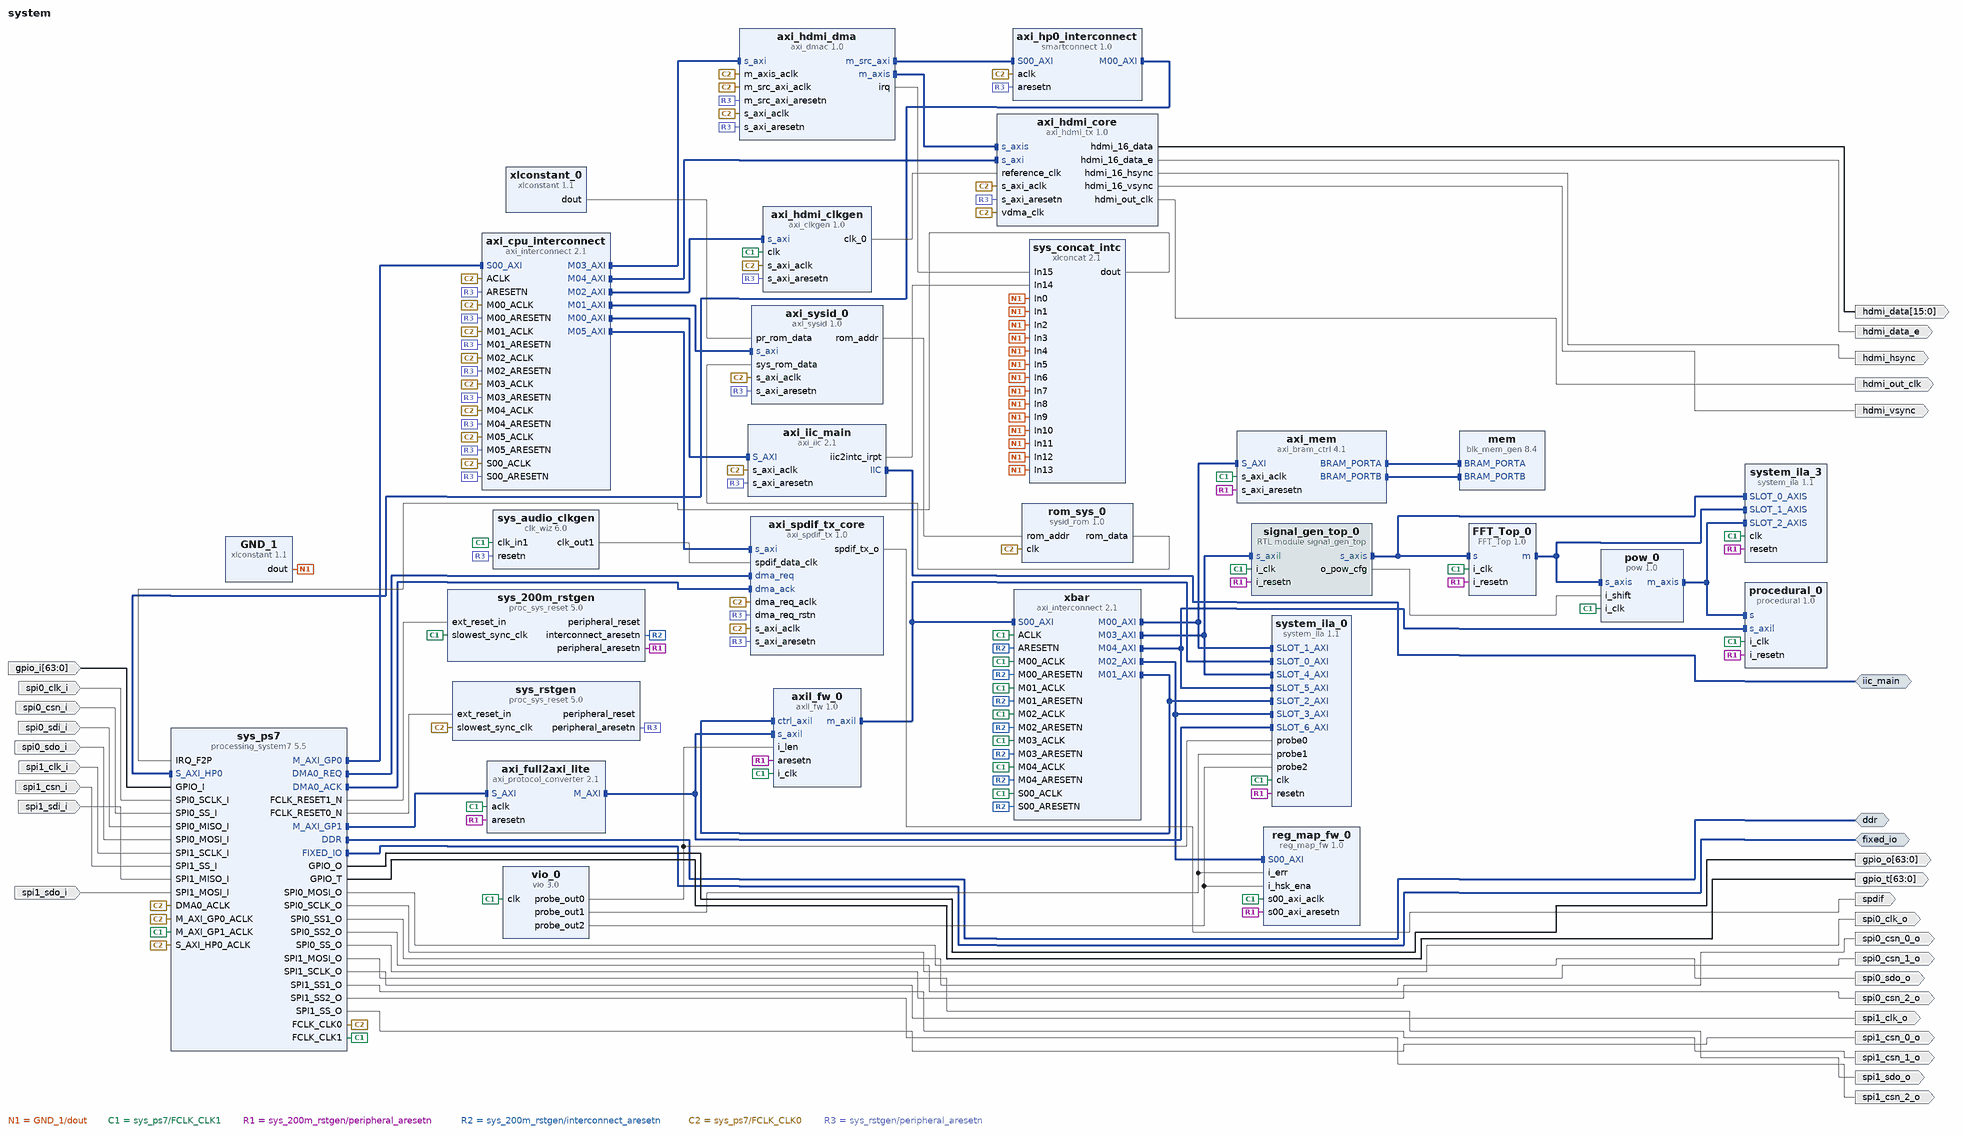
[diagram p0: block diagram of the top level]
# Vivado block design system, xc7z020clg484-1, Vivado 2021.1
create_bd_design system

create_bd_intf_port -mode Master -vlnv xilinx.com:interface:ddrx_rtl:1.0 ddr
create_bd_intf_port -mode Master -vlnv xilinx.com:display_processing_system7:fixedio_rtl:1.0 fixed_io
create_bd_intf_port -mode Master -vlnv xilinx.com:interface:iic_rtl:1.0 iic_main
create_bd_port -dir O spi0_csn_2_o
create_bd_port -dir O spi0_csn_1_o
create_bd_port -dir O spi0_csn_0_o
create_bd_port -dir I spi0_csn_i
create_bd_port -dir I spi0_clk_i
create_bd_port -dir O spi0_clk_o
create_bd_port -dir I spi0_sdo_i
create_bd_port -dir O spi0_sdo_o
create_bd_port -dir I spi0_sdi_i
create_bd_port -dir O spi1_csn_2_o
create_bd_port -dir O spi1_csn_1_o
create_bd_port -dir O spi1_csn_0_o
create_bd_port -dir I spi1_csn_i
create_bd_port -dir I spi1_clk_i
create_bd_port -dir O spi1_clk_o
create_bd_port -dir I spi1_sdo_i
create_bd_port -dir O spi1_sdo_o
create_bd_port -dir I spi1_sdi_i
create_bd_port -dir I -from 63 -to 0 gpio_i
create_bd_port -dir O -from 63 -to 0 gpio_o
create_bd_port -dir O -from 63 -to 0 gpio_t
create_bd_port -dir O hdmi_out_clk
create_bd_port -dir O hdmi_hsync
create_bd_port -dir O hdmi_vsync
create_bd_port -dir O hdmi_data_e
create_bd_port -dir O -from 15 -to 0 hdmi_data
create_bd_port -dir O spdif

create_bd_cell -type ip -vlnv xilinx.com:ip:processing_system7:5.5 sys_ps7
set_property -dict [list \
  CONFIG.PCW_APU_PERIPHERAL_FREQMHZ 666.666666 \
  CONFIG.PCW_CAN0_CAN0_IO {MIO 46 .. 47} \
  CONFIG.PCW_CAN0_PERIPHERAL_ENABLE 1 \
  CONFIG.PCW_CAN_PERIPHERAL_FREQMHZ 23.8095 \
  CONFIG.PCW_ENET0_ENET0_IO {MIO 16 .. 27} \
  CONFIG.PCW_ENET0_GRP_MDIO_ENABLE 1 \
  CONFIG.PCW_ENET0_GRP_MDIO_IO {MIO 52 .. 53} \
  CONFIG.PCW_ENET0_PERIPHERAL_ENABLE 1 \
  CONFIG.PCW_ENET0_PERIPHERAL_FREQMHZ {100 Mbps} \
  CONFIG.PCW_ENET0_RESET_ENABLE 1 \
  CONFIG.PCW_ENET0_RESET_IO {MIO 11} \
  CONFIG.PCW_ENET_RESET_ENABLE 1 \
  CONFIG.PCW_ENET_RESET_SELECT {Share reset pin} \
  CONFIG.PCW_EN_CLK1_PORT 1 \
  CONFIG.PCW_EN_RST1_PORT 1 \
  CONFIG.PCW_FCLK_CLK1_BUF TRUE \
  CONFIG.PCW_FPGA0_PERIPHERAL_FREQMHZ 100.0 \
  CONFIG.PCW_FPGA1_PERIPHERAL_FREQMHZ 200.0 \
  CONFIG.PCW_FPGA_FCLK1_ENABLE 1 \
  CONFIG.PCW_GPIO_EMIO_GPIO_ENABLE 1 \
  CONFIG.PCW_GPIO_EMIO_GPIO_IO 64 \
  CONFIG.PCW_GPIO_MIO_GPIO_ENABLE 1 \
  CONFIG.PCW_GPIO_MIO_GPIO_IO MIO \
  CONFIG.PCW_I2C0_GRP_INT_ENABLE 0 \
  CONFIG.PCW_I2C0_I2C0_IO {MIO 50 .. 51} \
  CONFIG.PCW_I2C0_PERIPHERAL_ENABLE 1 \
  CONFIG.PCW_I2C0_RESET_ENABLE 1 \
  CONFIG.PCW_I2C0_RESET_IO {MIO 13} \
  CONFIG.PCW_I2C_PERIPHERAL_FREQMHZ 111.111115 \
  CONFIG.PCW_I2C_RESET_ENABLE 1 \
  CONFIG.PCW_I2C_RESET_SELECT {Share reset pin} \
  CONFIG.PCW_IMPORT_BOARD_PRESET ZC702 \
  CONFIG.PCW_IRQ_F2P_INTR 1 \
  CONFIG.PCW_PRESET_BANK0_VOLTAGE {LVCMOS 1.8V} \
  CONFIG.PCW_PRESET_BANK1_VOLTAGE {LVCMOS 1.8V} \
  CONFIG.PCW_QSPI_GRP_FBCLK_ENABLE 1 \
  CONFIG.PCW_QSPI_GRP_FBCLK_IO {MIO 8} \
  CONFIG.PCW_QSPI_GRP_SINGLE_SS_ENABLE 1 \
  CONFIG.PCW_QSPI_GRP_SINGLE_SS_IO {MIO 1 .. 6} \
  CONFIG.PCW_QSPI_PERIPHERAL_ENABLE 1 \
  CONFIG.PCW_QSPI_QSPI_IO {MIO 1 .. 6} \
  CONFIG.PCW_SD0_GRP_CD_ENABLE 1 \
  CONFIG.PCW_SD0_GRP_CD_IO {MIO 0} \
  CONFIG.PCW_SD0_GRP_WP_ENABLE 1 \
  CONFIG.PCW_SD0_GRP_WP_IO {MIO 15} \
  CONFIG.PCW_SD0_PERIPHERAL_ENABLE 1 \
  CONFIG.PCW_SD0_SD0_IO {MIO 40 .. 45} \
  CONFIG.PCW_SDIO_PERIPHERAL_FREQMHZ 50 \
  CONFIG.PCW_SINGLE_QSPI_DATA_MODE x4 \
  CONFIG.PCW_SPI0_PERIPHERAL_ENABLE 1 \
  CONFIG.PCW_SPI0_SPI0_IO EMIO \
  CONFIG.PCW_SPI1_PERIPHERAL_ENABLE 1 \
  CONFIG.PCW_SPI1_SPI1_IO EMIO \
  CONFIG.PCW_UART1_PERIPHERAL_ENABLE 1 \
  CONFIG.PCW_UART1_UART1_IO {MIO 48 .. 49} \
  CONFIG.PCW_UART_PERIPHERAL_FREQMHZ 50 \
  CONFIG.PCW_UIPARAM_DDR_FREQ_MHZ 533.333333 \
  CONFIG.PCW_UIPARAM_DDR_PARTNO {MT41J256M8 HX-15E} \
  CONFIG.PCW_USB0_PERIPHERAL_ENABLE 1 \
  CONFIG.PCW_USB0_RESET_ENABLE 1 \
  CONFIG.PCW_USB0_RESET_IO {MIO 7} \
  CONFIG.PCW_USB0_USB0_IO {MIO 28 .. 39} \
  CONFIG.PCW_USB_RESET_ENABLE 1 \
  CONFIG.PCW_USB_RESET_SELECT {Share reset pin} \
  CONFIG.PCW_USE_DMA0 1 \
  CONFIG.PCW_USE_FABRIC_INTERRUPT 1 \
  CONFIG.PCW_USE_M_AXI_GP1 1 \
  CONFIG.PCW_USE_S_AXI_HP0 1 \
] [get_bd_cells sys_ps7]
# 424 more settings of sys_ps7 are not shown: defaults, MIO pin electricals, DDR timing, and values the tool derives
create_bd_cell -type ip -vlnv xilinx.com:ip:axi_iic:2.1 axi_iic_main
set_property -dict {CONFIG.IIC_BOARD_INTERFACE iic_main CONFIG.USE_BOARD_FLOW true} [get_bd_cells axi_iic_main]
create_bd_cell -type ip -vlnv xilinx.com:ip:xlconcat:2.1 sys_concat_intc
set_property -dict {CONFIG.NUM_PORTS 16} [get_bd_cells sys_concat_intc]
create_bd_cell -type ip -vlnv xilinx.com:ip:proc_sys_reset:5.0 sys_rstgen
set_property -dict {CONFIG.C_EXT_RST_WIDTH 1} [get_bd_cells sys_rstgen]
create_bd_cell -type ip -vlnv xilinx.com:ip:proc_sys_reset:5.0 sys_200m_rstgen
set_property -dict {CONFIG.C_EXT_RST_WIDTH 1} [get_bd_cells sys_200m_rstgen]
create_bd_cell -type ip -vlnv analog.com:user:axi_clkgen:1.0 axi_hdmi_clkgen
create_bd_cell -type ip -vlnv analog.com:user:axi_hdmi_tx:1.0 axi_hdmi_core
set_property -dict {CONFIG.INTERFACE 16_BIT} [get_bd_cells axi_hdmi_core]
create_bd_cell -type ip -vlnv analog.com:user:axi_dmac:1.0 axi_hdmi_dma
set_property -dict [list \
  CONFIG.AXI_SLICE_DEST false \
  CONFIG.AXI_SLICE_SRC false \
  CONFIG.CYCLIC true \
  CONFIG.DMA_2D_TRANSFER true \
  CONFIG.DMA_DATA_WIDTH_SRC 64 \
  CONFIG.DMA_TYPE_DEST 1 \
  CONFIG.DMA_TYPE_SRC 0 \
] [get_bd_cells axi_hdmi_dma]
create_bd_cell -type ip -vlnv xilinx.com:ip:clk_wiz:6.0 sys_audio_clkgen
set_property -dict [list \
  CONFIG.CLKOUT1_REQUESTED_OUT_FREQ 12.288 \
  CONFIG.PRIM_SOURCE No_buffer \
  CONFIG.RESET_TYPE ACTIVE_LOW \
  CONFIG.USE_LOCKED false \
  CONFIG.USE_PHASE_ALIGNMENT false \
  CONFIG.USE_RESET true \
] [get_bd_cells sys_audio_clkgen]
create_bd_cell -type ip -vlnv analog.com:user:axi_spdif_tx:1.0 axi_spdif_tx_core
set_property -dict {CONFIG.DMA_TYPE 1 CONFIG.S_AXI_ADDRESS_WIDTH 16} [get_bd_cells axi_spdif_tx_core]
create_bd_cell -type ip -vlnv analog.com:user:axi_sysid:1.0 axi_sysid_0
set_property -dict {CONFIG.ROM_ADDR_BITS 9} [get_bd_cells axi_sysid_0]
create_bd_cell -type ip -vlnv analog.com:user:sysid_rom:1.0 rom_sys_0
set_property -dict [list \
  CONFIG.PATH_TO_FILE /home/grigory/teset/hdl/projects/adv7511/zc702/mem_init_sys.txt \
  CONFIG.ROM_ADDR_BITS 9 \
] [get_bd_cells rom_sys_0]
create_bd_cell -type ip -vlnv xilinx.com:ip:xlconstant:1.1 GND_1
set_property -dict {CONFIG.CONST_VAL 0 CONFIG.CONST_WIDTH 1} [get_bd_cells GND_1]
create_bd_cell -type ip -vlnv xilinx.com:ip:axi_interconnect:2.1 axi_cpu_interconnect
set_property -dict {CONFIG.NUM_MI 6} [get_bd_cells axi_cpu_interconnect]
create_bd_cell -type ip -vlnv xilinx.com:ip:smartconnect:1.0 axi_hp0_interconnect
set_property -dict {CONFIG.NUM_MI 1 CONFIG.NUM_SI 1} [get_bd_cells axi_hp0_interconnect]
create_bd_cell -type ip -vlnv xilinx.com:ip:axi_protocol_converter:2.1 axi_full2axi_lite
set_property -dict [list \
  CONFIG.MI_PROTOCOL AXI4LITE \
  CONFIG.SI_PROTOCOL AXI3 \
  CONFIG.TRANSLATION_MODE 2 \
] [get_bd_cells axi_full2axi_lite]
create_bd_cell -type ip -vlnv xilinx.com:ip:axi_interconnect:2.1 xbar
set_property -dict [list \
  CONFIG.M00_HAS_DATA_FIFO 1 \
  CONFIG.M00_HAS_REGSLICE 3 \
  CONFIG.M01_HAS_DATA_FIFO 1 \
  CONFIG.M01_HAS_REGSLICE 3 \
  CONFIG.NUM_MI 5 \
  CONFIG.S00_HAS_DATA_FIFO 1 \
  CONFIG.S00_HAS_REGSLICE 4 \
] [get_bd_cells xbar]
create_bd_cell -type ip -vlnv xilinx.com:ip:blk_mem_gen:8.4 mem
set_property -dict [list \
  CONFIG.Assume_Synchronous_Clk true \
  CONFIG.Enable_B Use_ENB_Pin \
  CONFIG.Memory_Type True_Dual_Port_RAM \
  CONFIG.Port_B_Clock 100 \
  CONFIG.Port_B_Enable_Rate 100 \
  CONFIG.Port_B_Write_Rate 50 \
  CONFIG.Use_RSTB_Pin true \
] [get_bd_cells mem]
create_bd_cell -type ip -vlnv xilinx.com:ip:axi_bram_ctrl:4.1 axi_mem
set_property -dict {CONFIG.PROTOCOL AXI4LITE} [get_bd_cells axi_mem]
create_bd_cell -type ip -vlnv xilinx.com:ip:vio:3.0 vio_0
set_property -dict [list \
  CONFIG.C_NUM_PROBE_IN 0 \
  CONFIG.C_NUM_PROBE_OUT 3 \
  CONFIG.C_PROBE_OUT0_INIT_VAL 0x32 \
  CONFIG.C_PROBE_OUT0_WIDTH 10 \
  CONFIG.C_PROBE_OUT2_INIT_VAL 0x1F \
  CONFIG.C_PROBE_OUT2_WIDTH 5 \
] [get_bd_cells vio_0]
create_bd_cell -type ip -vlnv xilinx.com:ip:xlconstant:1.1 xlconstant_0
set_property -dict {CONFIG.CONST_VAL 0 CONFIG.CONST_WIDTH 32} [get_bd_cells xlconstant_0]
create_bd_cell -type ip -vlnv xilinx.com:ip:system_ila:1.1 system_ila_0
set_property -dict [list \
  CONFIG.C_INPUT_PIPE_STAGES 6 \
  CONFIG.C_MON_TYPE MIX \
  CONFIG.C_NUM_MONITOR_SLOTS 7 \
  CONFIG.C_NUM_OF_PROBES 3 \
  CONFIG.C_PROBE0_TYPE 0 \
  CONFIG.C_PROBE1_TYPE 0 \
  CONFIG.C_PROBE2_TYPE 0 \
  CONFIG.C_SLOT_0_APC_EN 0 \
  CONFIG.C_SLOT_0_AXI_AR_SEL_DATA 1 \
  CONFIG.C_SLOT_0_AXI_AR_SEL_TRIG 1 \
  CONFIG.C_SLOT_0_AXI_AW_SEL_DATA 1 \
  CONFIG.C_SLOT_0_AXI_AW_SEL_TRIG 1 \
  CONFIG.C_SLOT_0_AXI_B_SEL_DATA 1 \
  CONFIG.C_SLOT_0_AXI_B_SEL_TRIG 1 \
  CONFIG.C_SLOT_0_AXI_R_SEL_DATA 1 \
  CONFIG.C_SLOT_0_AXI_R_SEL_TRIG 1 \
  CONFIG.C_SLOT_0_AXI_W_SEL_DATA 1 \
  CONFIG.C_SLOT_0_AXI_W_SEL_TRIG 1 \
  CONFIG.C_SLOT_0_INTF_TYPE xilinx.com:interface:aximm_rtl:1.0 \
  CONFIG.C_SLOT_1_APC_EN 0 \
  CONFIG.C_SLOT_1_AXI_AR_SEL_DATA 1 \
  CONFIG.C_SLOT_1_AXI_AR_SEL_TRIG 1 \
  CONFIG.C_SLOT_1_AXI_AW_SEL_DATA 1 \
  CONFIG.C_SLOT_1_AXI_AW_SEL_TRIG 1 \
  CONFIG.C_SLOT_1_AXI_B_SEL_DATA 1 \
  CONFIG.C_SLOT_1_AXI_B_SEL_TRIG 1 \
  CONFIG.C_SLOT_1_AXI_R_SEL_DATA 1 \
  CONFIG.C_SLOT_1_AXI_R_SEL_TRIG 1 \
  CONFIG.C_SLOT_1_AXI_W_SEL_DATA 1 \
  CONFIG.C_SLOT_1_AXI_W_SEL_TRIG 1 \
  CONFIG.C_SLOT_1_INTF_TYPE xilinx.com:interface:aximm_rtl:1.0 \
  CONFIG.C_SLOT_2_APC_EN 0 \
  CONFIG.C_SLOT_2_AXI_AR_SEL_DATA 1 \
  CONFIG.C_SLOT_2_AXI_AR_SEL_TRIG 1 \
  CONFIG.C_SLOT_2_AXI_AW_SEL_DATA 1 \
  CONFIG.C_SLOT_2_AXI_AW_SEL_TRIG 1 \
  CONFIG.C_SLOT_2_AXI_B_SEL_DATA 1 \
  CONFIG.C_SLOT_2_AXI_B_SEL_TRIG 1 \
  CONFIG.C_SLOT_2_AXI_R_SEL_DATA 1 \
  CONFIG.C_SLOT_2_AXI_R_SEL_TRIG 1 \
  CONFIG.C_SLOT_2_AXI_W_SEL_DATA 1 \
  CONFIG.C_SLOT_2_AXI_W_SEL_TRIG 1 \
  CONFIG.C_SLOT_2_INTF_TYPE xilinx.com:interface:aximm_rtl:1.0 \
  CONFIG.C_SLOT_3_APC_EN 0 \
  CONFIG.C_SLOT_3_AXI_AR_SEL_DATA 1 \
  CONFIG.C_SLOT_3_AXI_AR_SEL_TRIG 1 \
  CONFIG.C_SLOT_3_AXI_AW_SEL_DATA 1 \
  CONFIG.C_SLOT_3_AXI_AW_SEL_TRIG 1 \
  CONFIG.C_SLOT_3_AXI_B_SEL_DATA 1 \
  CONFIG.C_SLOT_3_AXI_B_SEL_TRIG 1 \
  CONFIG.C_SLOT_3_AXI_R_SEL_DATA 1 \
  CONFIG.C_SLOT_3_AXI_R_SEL_TRIG 1 \
  CONFIG.C_SLOT_3_AXI_W_SEL_DATA 1 \
  CONFIG.C_SLOT_3_AXI_W_SEL_TRIG 1 \
  CONFIG.C_SLOT_3_INTF_TYPE xilinx.com:interface:aximm_rtl:1.0 \
  CONFIG.C_SLOT_4_APC_EN 0 \
  CONFIG.C_SLOT_4_AXI_AR_SEL_DATA 1 \
  CONFIG.C_SLOT_4_AXI_AR_SEL_TRIG 1 \
  CONFIG.C_SLOT_4_AXI_AW_SEL_DATA 1 \
  CONFIG.C_SLOT_4_AXI_AW_SEL_TRIG 1 \
  CONFIG.C_SLOT_4_AXI_B_SEL_DATA 1 \
  CONFIG.C_SLOT_4_AXI_B_SEL_TRIG 1 \
  CONFIG.C_SLOT_4_AXI_R_SEL_DATA 1 \
  CONFIG.C_SLOT_4_AXI_R_SEL_TRIG 1 \
  CONFIG.C_SLOT_4_AXI_W_SEL_DATA 1 \
  CONFIG.C_SLOT_4_AXI_W_SEL_TRIG 1 \
  CONFIG.C_SLOT_4_INTF_TYPE xilinx.com:interface:aximm_rtl:1.0 \
  CONFIG.C_SLOT_5_APC_EN 0 \
  CONFIG.C_SLOT_5_AXI_AR_SEL_DATA 1 \
  CONFIG.C_SLOT_5_AXI_AR_SEL_TRIG 1 \
  CONFIG.C_SLOT_5_AXI_AW_SEL_DATA 1 \
  CONFIG.C_SLOT_5_AXI_AW_SEL_TRIG 1 \
  CONFIG.C_SLOT_5_AXI_B_SEL_DATA 1 \
  CONFIG.C_SLOT_5_AXI_B_SEL_TRIG 1 \
  CONFIG.C_SLOT_5_AXI_R_SEL_DATA 1 \
  CONFIG.C_SLOT_5_AXI_R_SEL_TRIG 1 \
  CONFIG.C_SLOT_5_AXI_W_SEL_DATA 1 \
  CONFIG.C_SLOT_5_AXI_W_SEL_TRIG 1 \
  CONFIG.C_SLOT_5_INTF_TYPE xilinx.com:interface:aximm_rtl:1.0 \
  CONFIG.C_SLOT_6_APC_EN 0 \
  CONFIG.C_SLOT_6_AXI_AR_SEL_DATA 1 \
  CONFIG.C_SLOT_6_AXI_AR_SEL_TRIG 1 \
  CONFIG.C_SLOT_6_AXI_AW_SEL_DATA 1 \
  CONFIG.C_SLOT_6_AXI_AW_SEL_TRIG 1 \
  CONFIG.C_SLOT_6_AXI_B_SEL_DATA 1 \
  CONFIG.C_SLOT_6_AXI_B_SEL_TRIG 1 \
  CONFIG.C_SLOT_6_AXI_R_SEL_DATA 1 \
  CONFIG.C_SLOT_6_AXI_R_SEL_TRIG 1 \
  CONFIG.C_SLOT_6_AXI_W_SEL_DATA 1 \
  CONFIG.C_SLOT_6_AXI_W_SEL_TRIG 1 \
  CONFIG.C_SLOT_6_INTF_TYPE xilinx.com:interface:aximm_rtl:1.0 \
] [get_bd_cells system_ila_0]
create_bd_cell -type ip -vlnv xilinx.com:ip:system_ila:1.1 system_ila_3
set_property -dict [list \
  CONFIG.ALL_PROBE_SAME_MU_CNT 2 \
  CONFIG.C_DATA_DEPTH 16384 \
  CONFIG.C_EN_STRG_QUAL 1 \
  CONFIG.C_INPUT_PIPE_STAGES 6 \
  CONFIG.C_MON_TYPE INTERFACE \
  CONFIG.C_NUM_MONITOR_SLOTS 3 \
  CONFIG.C_PROBE0_MU_CNT 2 \
  CONFIG.C_SLOT 2 \
  CONFIG.C_SLOT_0_APC_EN 0 \
  CONFIG.C_SLOT_0_AXI_DATA_SEL 1 \
  CONFIG.C_SLOT_0_AXI_TRIG_SEL 1 \
  CONFIG.C_SLOT_0_INTF_TYPE xilinx.com:interface:axis_rtl:1.0 \
  CONFIG.C_SLOT_1_INTF_TYPE xilinx.com:interface:axis_rtl:1.0 \
  CONFIG.C_SLOT_2_INTF_TYPE xilinx.com:interface:axis_rtl:1.0 \
] [get_bd_cells system_ila_3]
create_bd_cell -type ip -vlnv user.org:user:FFT_Top:1.0 FFT_Top_0
create_bd_cell -type ip -vlnv user.org:user:axil_fw:1.0 axil_fw_0
set_property -dict {CONFIG.G_WD_WDT 10} [get_bd_cells axil_fw_0]
create_bd_cell -type ip -vlnv user.org:user:procedural:1.0 procedural_0
create_bd_cell -type ip -vlnv user.org:user:reg_map_fw:1.0 reg_map_fw_0
create_bd_cell -type module -reference signal_gen_top signal_gen_top_0
create_bd_cell -type ip -vlnv user.org:user:pow:1.0 pow_0

# ---- connections ----

connect_bd_intf_net -intf_net FFT_Top_0_m [get_bd_intf_pins FFT_Top_0/m] [get_bd_intf_pins pow_0/s_axis]
connect_bd_intf_net [get_bd_intf_pins FFT_Top_0/m] [get_bd_intf_pins system_ila_3/SLOT_1_AXIS]
connect_bd_intf_net [get_bd_intf_pins axi_cpu_interconnect/S00_AXI] [get_bd_intf_pins sys_ps7/M_AXI_GP0]
connect_bd_intf_net [get_bd_intf_pins axi_cpu_interconnect/M00_AXI] [get_bd_intf_pins axi_iic_main/S_AXI]
connect_bd_intf_net [get_bd_intf_pins axi_cpu_interconnect/M01_AXI] [get_bd_intf_pins axi_sysid_0/s_axi]
connect_bd_intf_net [get_bd_intf_pins axi_cpu_interconnect/M02_AXI] [get_bd_intf_pins axi_hdmi_clkgen/s_axi]
connect_bd_intf_net [get_bd_intf_pins axi_cpu_interconnect/M03_AXI] [get_bd_intf_pins axi_hdmi_dma/s_axi]
connect_bd_intf_net [get_bd_intf_pins axi_cpu_interconnect/M04_AXI] [get_bd_intf_pins axi_hdmi_core/s_axi]
connect_bd_intf_net [get_bd_intf_pins axi_cpu_interconnect/M05_AXI] [get_bd_intf_pins axi_spdif_tx_core/s_axi]
connect_bd_intf_net -intf_net axi_full2axi_lite_M_AXI [get_bd_intf_pins axil_fw_0/s_axil] [get_bd_intf_pins axi_full2axi_lite/M_AXI]
connect_bd_intf_net [get_bd_intf_pins axil_fw_0/s_axil] [get_bd_intf_pins system_ila_0/SLOT_6_AXI]
connect_bd_intf_net [get_bd_intf_pins axi_hdmi_dma/m_axis] [get_bd_intf_pins axi_hdmi_core/s_axis]
connect_bd_intf_net [get_bd_intf_pins axi_hp0_interconnect/S00_AXI] [get_bd_intf_pins axi_hdmi_dma/m_src_axi]
connect_bd_intf_net [get_bd_intf_pins axi_hp0_interconnect/M00_AXI] [get_bd_intf_pins sys_ps7/S_AXI_HP0]
connect_bd_intf_net [get_bd_intf_ports iic_main] [get_bd_intf_pins axi_iic_main/IIC]
connect_bd_intf_net [get_bd_intf_pins mem/BRAM_PORTA] [get_bd_intf_pins axi_mem/BRAM_PORTA]
connect_bd_intf_net [get_bd_intf_pins mem/BRAM_PORTB] [get_bd_intf_pins axi_mem/BRAM_PORTB]
connect_bd_intf_net [get_bd_intf_pins sys_ps7/DMA0_REQ] [get_bd_intf_pins axi_spdif_tx_core/dma_req]
connect_bd_intf_net -intf_net axil_fw_0_m_axil [get_bd_intf_pins axil_fw_0/m_axil] [get_bd_intf_pins xbar/S00_AXI]
connect_bd_intf_net [get_bd_intf_pins axil_fw_0/m_axil] [get_bd_intf_pins system_ila_0/SLOT_0_AXI]
connect_bd_intf_net -intf_net lite_xbar_M00_AXI [get_bd_intf_pins axi_mem/S_AXI] [get_bd_intf_pins xbar/M00_AXI]
connect_bd_intf_net [get_bd_intf_pins axi_mem/S_AXI] [get_bd_intf_pins system_ila_0/SLOT_1_AXI]
connect_bd_intf_net -intf_net pow_0_m_axis [get_bd_intf_pins pow_0/m_axis] [get_bd_intf_pins procedural_0/s]
connect_bd_intf_net [get_bd_intf_pins pow_0/m_axis] [get_bd_intf_pins system_ila_3/SLOT_2_AXIS]
connect_bd_intf_net -intf_net signal_gen_top_0_s_axis [get_bd_intf_pins signal_gen_top_0/s_axis] [get_bd_intf_pins FFT_Top_0/s]
connect_bd_intf_net [get_bd_intf_pins signal_gen_top_0/s_axis] [get_bd_intf_pins system_ila_3/SLOT_0_AXIS]
connect_bd_intf_net [get_bd_intf_ports ddr] [get_bd_intf_pins sys_ps7/DDR]
connect_bd_intf_net [get_bd_intf_pins sys_ps7/DMA0_ACK] [get_bd_intf_pins axi_spdif_tx_core/dma_ack]
connect_bd_intf_net [get_bd_intf_ports fixed_io] [get_bd_intf_pins sys_ps7/FIXED_IO]
connect_bd_intf_net [get_bd_intf_pins axi_full2axi_lite/S_AXI] [get_bd_intf_pins sys_ps7/M_AXI_GP1]
connect_bd_intf_net -intf_net xbar_M01_AXI [get_bd_intf_pins xbar/M01_AXI] [get_bd_intf_pins axil_fw_0/ctrl_axil]
connect_bd_intf_net [get_bd_intf_pins xbar/M01_AXI] [get_bd_intf_pins system_ila_0/SLOT_2_AXI]
connect_bd_intf_net -intf_net xbar_M02_AXI [get_bd_intf_pins xbar/M02_AXI] [get_bd_intf_pins reg_map_fw_0/S00_AXI]
connect_bd_intf_net [get_bd_intf_pins xbar/M02_AXI] [get_bd_intf_pins system_ila_0/SLOT_3_AXI]
connect_bd_intf_net -intf_net xbar_M03_AXI [get_bd_intf_pins xbar/M03_AXI] [get_bd_intf_pins signal_gen_top_0/s_axil]
connect_bd_intf_net [get_bd_intf_pins xbar/M03_AXI] [get_bd_intf_pins system_ila_0/SLOT_4_AXI]
connect_bd_intf_net -intf_net xbar_M04_AXI [get_bd_intf_pins xbar/M04_AXI] [get_bd_intf_pins procedural_0/s_axil]
connect_bd_intf_net [get_bd_intf_pins xbar/M04_AXI] [get_bd_intf_pins system_ila_0/SLOT_5_AXI]
connect_bd_net [get_bd_pins GND_1/dout] \
  [get_bd_pins sys_concat_intc/In13] [get_bd_pins sys_concat_intc/In12] [get_bd_pins sys_concat_intc/In11] \
  [get_bd_pins sys_concat_intc/In10] [get_bd_pins sys_concat_intc/In9] [get_bd_pins sys_concat_intc/In8] \
  [get_bd_pins sys_concat_intc/In7] [get_bd_pins sys_concat_intc/In6] [get_bd_pins sys_concat_intc/In5] \
  [get_bd_pins sys_concat_intc/In4] [get_bd_pins sys_concat_intc/In3] [get_bd_pins sys_concat_intc/In2] \
  [get_bd_pins sys_concat_intc/In1] [get_bd_pins sys_concat_intc/In0]
connect_bd_net [get_bd_pins axi_hdmi_clkgen/clk_0] [get_bd_pins axi_hdmi_core/reference_clk]
connect_bd_net [get_bd_pins axi_hdmi_core/hdmi_16_data] [get_bd_ports hdmi_data]
connect_bd_net [get_bd_pins axi_hdmi_core/hdmi_16_data_e] [get_bd_ports hdmi_data_e]
connect_bd_net [get_bd_pins axi_hdmi_core/hdmi_16_hsync] [get_bd_ports hdmi_hsync]
connect_bd_net [get_bd_pins axi_hdmi_core/hdmi_16_vsync] [get_bd_ports hdmi_vsync]
connect_bd_net [get_bd_pins axi_hdmi_core/hdmi_out_clk] [get_bd_ports hdmi_out_clk]
connect_bd_net [get_bd_pins axi_hdmi_dma/irq] [get_bd_pins sys_concat_intc/In15]
connect_bd_net [get_bd_pins axi_iic_main/iic2intc_irpt] [get_bd_pins sys_concat_intc/In14]
connect_bd_net [get_bd_pins axi_spdif_tx_core/spdif_tx_o] [get_bd_ports spdif]
connect_bd_net [get_bd_pins axi_sysid_0/rom_addr] [get_bd_pins rom_sys_0/rom_addr]
connect_bd_net [get_bd_ports gpio_i] [get_bd_pins sys_ps7/GPIO_I]
connect_bd_net [get_bd_pins rom_sys_0/rom_data] [get_bd_pins axi_sysid_0/sys_rom_data]
connect_bd_net [get_bd_pins signal_gen_top_0/o_pow_cfg] [get_bd_pins pow_0/i_shift]
connect_bd_net [get_bd_ports spi0_clk_i] [get_bd_pins sys_ps7/SPI0_SCLK_I]
connect_bd_net [get_bd_ports spi0_csn_i] [get_bd_pins sys_ps7/SPI0_SS_I]
connect_bd_net [get_bd_ports spi0_sdi_i] [get_bd_pins sys_ps7/SPI0_MISO_I]
connect_bd_net [get_bd_ports spi0_sdo_i] [get_bd_pins sys_ps7/SPI0_MOSI_I]
connect_bd_net [get_bd_ports spi1_clk_i] [get_bd_pins sys_ps7/SPI1_SCLK_I]
connect_bd_net [get_bd_ports spi1_csn_i] [get_bd_pins sys_ps7/SPI1_SS_I]
connect_bd_net [get_bd_ports spi1_sdi_i] [get_bd_pins sys_ps7/SPI1_MISO_I]
connect_bd_net [get_bd_ports spi1_sdo_i] [get_bd_pins sys_ps7/SPI1_MOSI_I]
connect_bd_net -net sys_200m_clk [get_bd_pins sys_ps7/FCLK_CLK1] \
  [get_bd_pins sys_200m_rstgen/slowest_sync_clk] [get_bd_pins axi_hdmi_clkgen/clk] [get_bd_pins sys_audio_clkgen/clk_in1] \
  [get_bd_pins axi_full2axi_lite/aclk] [get_bd_pins xbar/ACLK] [get_bd_pins xbar/S00_ACLK] [get_bd_pins xbar/M00_ACLK] \
  [get_bd_pins axi_mem/s_axi_aclk] [get_bd_pins sys_ps7/M_AXI_GP1_ACLK] [get_bd_pins xbar/M01_ACLK] [get_bd_pins vio_0/clk] \
  [get_bd_pins xbar/M02_ACLK] [get_bd_pins system_ila_0/clk] [get_bd_pins xbar/M03_ACLK] [get_bd_pins xbar/M04_ACLK] \
  [get_bd_pins system_ila_3/clk] [get_bd_pins FFT_Top_0/i_clk] [get_bd_pins axil_fw_0/i_clk] [get_bd_pins procedural_0/i_clk] \
  [get_bd_pins reg_map_fw_0/s00_axi_aclk] [get_bd_pins signal_gen_top_0/i_clk] [get_bd_pins pow_0/i_clk]
# net sys_200m_reset has one end: sys_200m_rstgen/peripheral_reset
connect_bd_net -net sys_200m_resetn [get_bd_pins sys_200m_rstgen/peripheral_aresetn] \
  [get_bd_pins axi_mem/s_axi_aresetn] [get_bd_pins axi_full2axi_lite/aresetn] [get_bd_pins system_ila_0/resetn] \
  [get_bd_pins system_ila_3/resetn] [get_bd_pins FFT_Top_0/i_resetn] [get_bd_pins axil_fw_0/aresetn] \
  [get_bd_pins procedural_0/i_resetn] [get_bd_pins reg_map_fw_0/s00_axi_aresetn] [get_bd_pins signal_gen_top_0/i_resetn]
connect_bd_net [get_bd_pins sys_200m_rstgen/interconnect_aresetn] \
  [get_bd_pins xbar/ARESETN] [get_bd_pins xbar/S00_ARESETN] [get_bd_pins xbar/M00_ARESETN] [get_bd_pins xbar/M01_ARESETN] \
  [get_bd_pins xbar/M02_ARESETN] [get_bd_pins xbar/M03_ARESETN] [get_bd_pins xbar/M04_ARESETN]
connect_bd_net [get_bd_pins sys_audio_clkgen/clk_out1] [get_bd_pins axi_spdif_tx_core/spdif_data_clk]
connect_bd_net [get_bd_pins sys_concat_intc/dout] [get_bd_pins sys_ps7/IRQ_F2P]
connect_bd_net -net sys_cpu_clk [get_bd_pins sys_ps7/FCLK_CLK0] \
  [get_bd_pins sys_rstgen/slowest_sync_clk] [get_bd_pins axi_hdmi_core/vdma_clk] [get_bd_pins axi_hdmi_dma/s_axi_aclk] \
  [get_bd_pins axi_hdmi_dma/m_src_axi_aclk] [get_bd_pins axi_hdmi_dma/m_axis_aclk] \
  [get_bd_pins axi_spdif_tx_core/dma_req_aclk] [get_bd_pins sys_ps7/DMA0_ACLK] [get_bd_pins rom_sys_0/clk] \
  [get_bd_pins axi_cpu_interconnect/ACLK] [get_bd_pins axi_cpu_interconnect/S00_ACLK] [get_bd_pins sys_ps7/M_AXI_GP0_ACLK] \
  [get_bd_pins axi_cpu_interconnect/M00_ACLK] [get_bd_pins axi_iic_main/s_axi_aclk] \
  [get_bd_pins axi_cpu_interconnect/M01_ACLK] [get_bd_pins axi_sysid_0/s_axi_aclk] \
  [get_bd_pins axi_cpu_interconnect/M02_ACLK] [get_bd_pins axi_hdmi_clkgen/s_axi_aclk] \
  [get_bd_pins axi_cpu_interconnect/M03_ACLK] [get_bd_pins axi_cpu_interconnect/M04_ACLK] \
  [get_bd_pins axi_hdmi_core/s_axi_aclk] [get_bd_pins axi_cpu_interconnect/M05_ACLK] \
  [get_bd_pins axi_spdif_tx_core/s_axi_aclk] [get_bd_pins axi_hp0_interconnect/aclk] [get_bd_pins sys_ps7/S_AXI_HP0_ACLK]
# net sys_cpu_reset has one end: sys_rstgen/peripheral_reset
connect_bd_net -net sys_cpu_resetn [get_bd_pins sys_rstgen/peripheral_aresetn] \
  [get_bd_pins axi_hdmi_dma/s_axi_aresetn] [get_bd_pins axi_hdmi_dma/m_src_axi_aresetn] \
  [get_bd_pins axi_spdif_tx_core/dma_req_rstn] [get_bd_pins sys_audio_clkgen/resetn] \
  [get_bd_pins axi_cpu_interconnect/ARESETN] [get_bd_pins axi_cpu_interconnect/S00_ARESETN] \
  [get_bd_pins axi_cpu_interconnect/M00_ARESETN] [get_bd_pins axi_iic_main/s_axi_aresetn] \
  [get_bd_pins axi_cpu_interconnect/M01_ARESETN] [get_bd_pins axi_sysid_0/s_axi_aresetn] \
  [get_bd_pins axi_cpu_interconnect/M02_ARESETN] [get_bd_pins axi_hdmi_clkgen/s_axi_aresetn] \
  [get_bd_pins axi_cpu_interconnect/M03_ARESETN] [get_bd_pins axi_cpu_interconnect/M04_ARESETN] \
  [get_bd_pins axi_hdmi_core/s_axi_aresetn] [get_bd_pins axi_cpu_interconnect/M05_ARESETN] \
  [get_bd_pins axi_spdif_tx_core/s_axi_aresetn] [get_bd_pins axi_hp0_interconnect/aresetn]
connect_bd_net [get_bd_pins sys_ps7/FCLK_RESET0_N] [get_bd_pins sys_rstgen/ext_reset_in]
connect_bd_net [get_bd_pins sys_ps7/FCLK_RESET1_N] [get_bd_pins sys_200m_rstgen/ext_reset_in]
connect_bd_net [get_bd_pins sys_ps7/GPIO_O] [get_bd_ports gpio_o]
connect_bd_net [get_bd_pins sys_ps7/GPIO_T] [get_bd_ports gpio_t]
connect_bd_net [get_bd_pins sys_ps7/SPI0_MOSI_O] [get_bd_ports spi0_sdo_o]
connect_bd_net [get_bd_pins sys_ps7/SPI0_SCLK_O] [get_bd_ports spi0_clk_o]
connect_bd_net [get_bd_pins sys_ps7/SPI0_SS1_O] [get_bd_ports spi0_csn_1_o]
connect_bd_net [get_bd_pins sys_ps7/SPI0_SS2_O] [get_bd_ports spi0_csn_2_o]
connect_bd_net [get_bd_pins sys_ps7/SPI0_SS_O] [get_bd_ports spi0_csn_0_o]
connect_bd_net [get_bd_pins sys_ps7/SPI1_MOSI_O] [get_bd_ports spi1_sdo_o]
connect_bd_net [get_bd_pins sys_ps7/SPI1_SCLK_O] [get_bd_ports spi1_clk_o]
connect_bd_net [get_bd_pins sys_ps7/SPI1_SS1_O] [get_bd_ports spi1_csn_1_o]
connect_bd_net [get_bd_pins sys_ps7/SPI1_SS2_O] [get_bd_ports spi1_csn_2_o]
connect_bd_net [get_bd_pins sys_ps7/SPI1_SS_O] [get_bd_ports spi1_csn_0_o]
connect_bd_net -net vio_0_probe_out0 [get_bd_pins vio_0/probe_out0] [get_bd_pins system_ila_0/probe0] [get_bd_pins axil_fw_0/i_len]
connect_bd_net -net vio_0_probe_out1 [get_bd_pins vio_0/probe_out1] [get_bd_pins system_ila_0/probe1] [get_bd_pins reg_map_fw_0/i_err]
connect_bd_net -net vio_0_probe_out2 [get_bd_pins vio_0/probe_out2] [get_bd_pins system_ila_0/probe2] [get_bd_pins reg_map_fw_0/i_hsk_ena]
connect_bd_net [get_bd_pins xlconstant_0/dout] [get_bd_pins axi_sysid_0/pr_rom_data]
set_property HDL_ATTRIBUTE.BMM_INFO_PROCESSOR {arm > system axi_mem} [get_bd_cells sys_ps7]
set_property HDL_ATTRIBUTE.KEEP_HIERARCHY yes [get_bd_cells sys_ps7]
set_property HDL_ATTRIBUTE.BMM_INFO_ADDRESS_SPACE {byte  0x80000000 32 > system mem} [get_bd_cells axi_mem]
set_property HDL_ATTRIBUTE.KEEP_HIERARCHY yes [get_bd_cells axi_mem]
set_property HDL_ATTRIBUTE.DEBUG true [get_bd_intf_nets FFT_Top_0_m]
set_property HDL_ATTRIBUTE.MARK_DEBUG true [get_bd_intf_nets FFT_Top_0_m]
set_property HDL_ATTRIBUTE.DEBUG true [get_bd_intf_nets axi_full2axi_lite_M_AXI]
set_property HDL_ATTRIBUTE.MARK_DEBUG true [get_bd_intf_nets axi_full2axi_lite_M_AXI]
set_property HDL_ATTRIBUTE.DEBUG true [get_bd_intf_nets axil_fw_0_m_axil]
set_property HDL_ATTRIBUTE.MARK_DEBUG true [get_bd_intf_nets axil_fw_0_m_axil]
set_property HDL_ATTRIBUTE.DEBUG true [get_bd_intf_nets lite_xbar_M00_AXI]
set_property HDL_ATTRIBUTE.MARK_DEBUG true [get_bd_intf_nets lite_xbar_M00_AXI]
set_property HDL_ATTRIBUTE.DEBUG true [get_bd_intf_nets pow_0_m_axis]
set_property HDL_ATTRIBUTE.MARK_DEBUG true [get_bd_intf_nets pow_0_m_axis]
set_property HDL_ATTRIBUTE.DEBUG true [get_bd_intf_nets signal_gen_top_0_s_axis]
set_property HDL_ATTRIBUTE.MARK_DEBUG true [get_bd_intf_nets signal_gen_top_0_s_axis]
set_property HDL_ATTRIBUTE.DEBUG true [get_bd_intf_nets xbar_M01_AXI]
set_property HDL_ATTRIBUTE.MARK_DEBUG true [get_bd_intf_nets xbar_M01_AXI]
set_property HDL_ATTRIBUTE.DEBUG true [get_bd_intf_nets xbar_M02_AXI]
set_property HDL_ATTRIBUTE.MARK_DEBUG true [get_bd_intf_nets xbar_M02_AXI]
set_property HDL_ATTRIBUTE.DEBUG true [get_bd_intf_nets xbar_M03_AXI]
set_property HDL_ATTRIBUTE.MARK_DEBUG true [get_bd_intf_nets xbar_M03_AXI]
set_property HDL_ATTRIBUTE.DEBUG true [get_bd_intf_nets xbar_M04_AXI]
set_property HDL_ATTRIBUTE.MARK_DEBUG true [get_bd_intf_nets xbar_M04_AXI]
set_property HDL_ATTRIBUTE.DEBUG true [get_bd_nets vio_0_probe_out0]
set_property HDL_ATTRIBUTE.MARK_DEBUG true [get_bd_nets vio_0_probe_out0]
set_property HDL_ATTRIBUTE.DEBUG true [get_bd_nets vio_0_probe_out1]
set_property HDL_ATTRIBUTE.MARK_DEBUG true [get_bd_nets vio_0_probe_out1]
set_property HDL_ATTRIBUTE.DEBUG true [get_bd_nets vio_0_probe_out2]
set_property HDL_ATTRIBUTE.MARK_DEBUG true [get_bd_nets vio_0_probe_out2]

# ---- address map ----
assign_bd_address -offset 0x00000000 -range 1G -target_address_space [get_bd_addr_spaces axi_hdmi_dma/m_src_axi] [get_bd_addr_segs sys_ps7/S_AXI_HP0/HP0_DDR_LOWOCM]
assign_bd_address -offset 0x00000 -range 4K -target_address_space [get_bd_addr_spaces axil_fw_0/m_axil] [get_bd_addr_segs axi_mem/S_AXI/Mem0]
assign_bd_address -offset 0x01000 -range 4K -target_address_space [get_bd_addr_spaces axil_fw_0/m_axil] [get_bd_addr_segs reg_map_fw_0/S00_AXI/S00_AXI_reg]
assign_bd_address -offset 0x02000 -range 4K -target_address_space [get_bd_addr_spaces axil_fw_0/m_axil] [get_bd_addr_segs procedural_0/s_axil/reg0]
assign_bd_address -offset 0x03000 -range 4K -target_address_space [get_bd_addr_spaces axil_fw_0/m_axil] [get_bd_addr_segs signal_gen_top_0/s_axil/reg0]
assign_bd_address -offset 0x10000 -range 4K -target_address_space [get_bd_addr_spaces axil_fw_0/m_axil] [get_bd_addr_segs axil_fw_0/ctrl_axil/reg0]
assign_bd_address -offset 0x41600000 -range 4K -target_address_space [get_bd_addr_spaces sys_ps7/Data] [get_bd_addr_segs axi_iic_main/S_AXI/Reg]
assign_bd_address -offset 0x43000000 -range 4K -target_address_space [get_bd_addr_spaces sys_ps7/Data] [get_bd_addr_segs axi_hdmi_dma/s_axi/axi_lite]
assign_bd_address -offset 0x45000000 -range 64K -target_address_space [get_bd_addr_spaces sys_ps7/Data] [get_bd_addr_segs axi_sysid_0/s_axi/axi_lite]
assign_bd_address -offset 0x70E00000 -range 64K -target_address_space [get_bd_addr_spaces sys_ps7/Data] [get_bd_addr_segs axi_hdmi_core/s_axi/axi_lite]
assign_bd_address -offset 0x75C00000 -range 64K -target_address_space [get_bd_addr_spaces sys_ps7/Data] [get_bd_addr_segs axi_spdif_tx_core/s_axi/axi_lite]
assign_bd_address -offset 0x79000000 -range 64K -target_address_space [get_bd_addr_spaces sys_ps7/Data] [get_bd_addr_segs axi_hdmi_clkgen/s_axi/axi_lite]
assign_bd_address -offset 0x83C00000 -range 1M -target_address_space [get_bd_addr_spaces sys_ps7/Data] [get_bd_addr_segs axil_fw_0/s_axil/reg0]

validate_bd_design
save_bd_design
